# Altium schematic sheet NNP-DWG-125-001-000 PG4 Schematic Drawing Pg7.SchDoc
size B; Address1: 300 Artini St.; Address2: Oberlin, OH  44074; DocumentNumber: 51-2002-01; Revision: 04; SheetNumber: 7; SheetTotal: 8; PageSetup: Record=PageOptions|CenterHorizontal=True|CenterVertical=True|PrintScale=1.09|XCorrection=1.00|YCorrection=1.00|PrintKind=0|BorderSize=5000000|LeftOffset=0|BottomOffset=0|Orientation=2|PaperLength=4318|PaperWidth=2794|Scale=100|PaperSource=7|PrintQuality=-3|MediaType=1|DitherType=10|PrintScaleMode=1|PaperKind=11" x 17"|PaperIndex=17; DocName: **
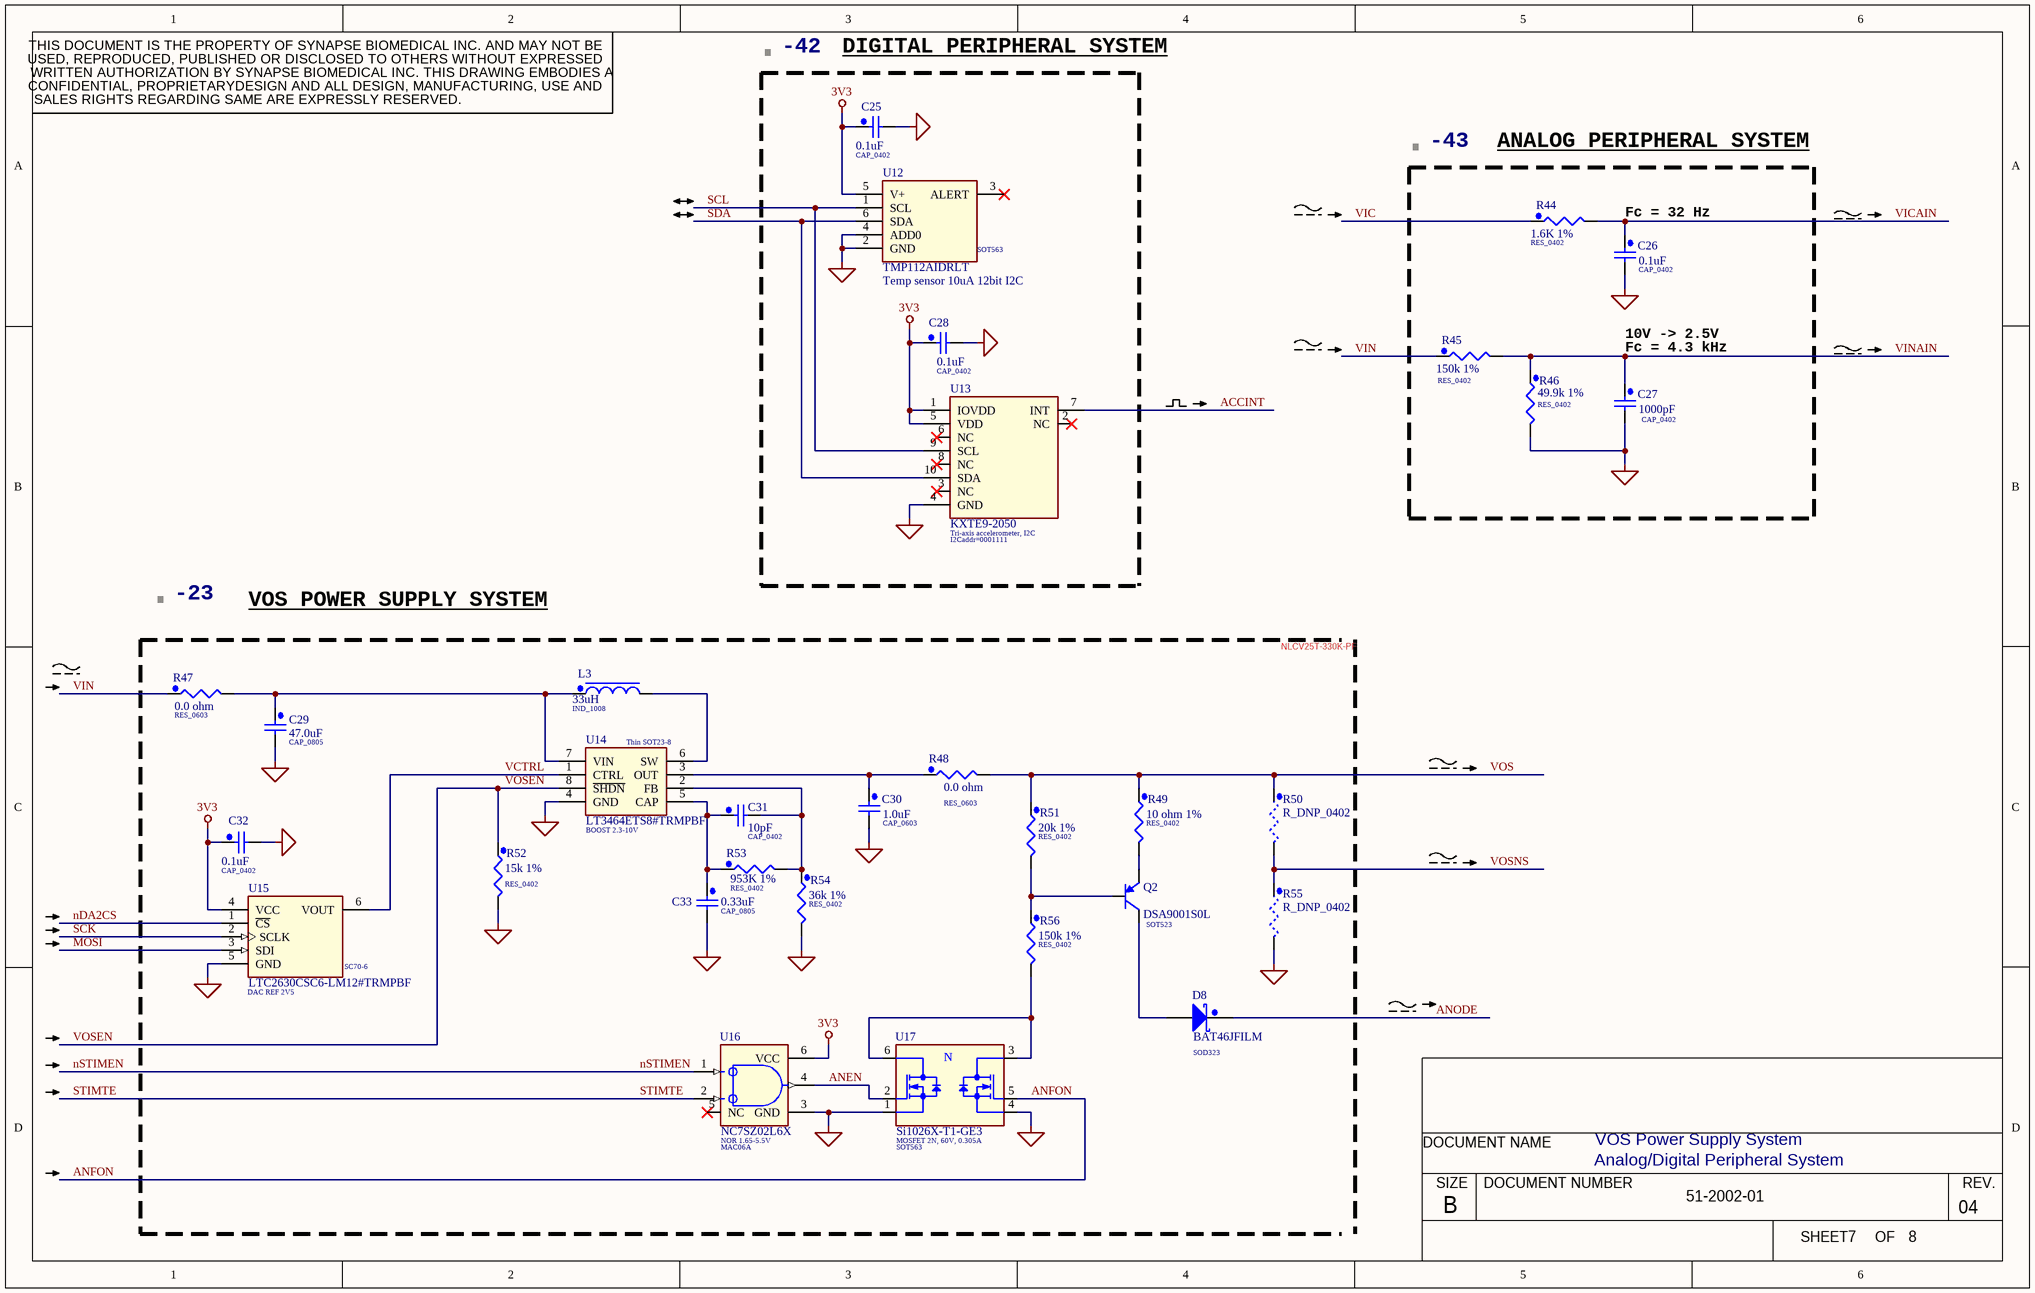
[diagram p0: NNP-DWG-125-001-000 PG4 Schematic Drawing Pg7.SchDoc]

## Parts
-23  XDESCRIPTION: VOS POWER SUPPLY SYSTEM  (hidden comment: BOM_S1)  (no BOM)
-42  XDESCRIPTION: DIGITAL PERIPHERAL SYSTEM  (hidden comment: BOM_S1)  (no BOM)
-43  XDESCRIPTION: ANALOG PERIPHERAL SYSTEM  (hidden comment: BOM_S1)  (no BOM)
C25  value 0.1uF  [CAP_0402]  (hidden comment: C_100n_X7R_16_0402_10%)
C26  value 0.1uF  [CAP_0402]  (hidden comment: C_100n_X7R_16_0402_10%)
C27  value 1000pF  [CAP_0402]  (hidden comment: C_1n_C0G_50_0402_5%)
C28  value 0.1uF  [CAP_0402]  (hidden comment: C_100n_X7R_16_0402_10%)
C29  value 47.0uF  [CAP_0805]  (hidden comment: C_47u_X5R_10_0805_20%)
C30  value 1.0uF  [CAP_0603]  (hidden comment: C_1u_X5R_50_0603_10%)
C31  value 10pF  [CAP_0402]  (hidden comment: C_10p_C0G_50_0402_5%)
C32  value 0.1uF  [CAP_0402]  (hidden comment: C_100n_X7R_16_0402_10%)
C33  value 0.33uF  [CAP_0805]  (hidden comment: C_330n_X7R_50_0805_10%)
D8  value BAT46JFILM  [SOD323]  (hidden comment: D_100_150m_SOD323)
L3  value 33uH  [IND_1008]  (hidden comment: 33uH, 120mA, 10%, RoHS)
Q2  MPN: DSA9001S0L  [SOT523]  (hidden comment: Q_-50_-100m_SOT523)
R44  value 1.6K 1%  [RES_0402]  (hidden comment: R_1k6_0402)
R45  value 150k 1%  [RES_0402]  (hidden comment: R_150k_0402)
R46  value 49.9k 1%  [RES_0402]  (hidden comment: R_49k9_0402)
R47  value 0.0 ohm  [RES_0603]  (hidden comment: R_0_0603)
R48  value 0.0 ohm  [RES_0603]  (hidden comment: R_0_0603)
R49  value 10 ohm 1%  [RES_0402]  (hidden comment: R_10_0402)
R50  R_DNP_0402  [RES_0402]  (no BOM)
R51  value 20k 1%  [RES_0402]  (hidden comment: R_20k_0402)
R52  value 15k 1%  [RES_0402]  (hidden comment: R_15k_0402)
R53  value 953K 1%  [RES_0402]  (hidden comment: R_953k_0402)
R54  value 36k 1%  [RES_0402]  (hidden comment: R_36k_0402)
R55  R_DNP_0402  [RES_0402]  (no BOM)
R56  value 150k 1%  [RES_0402]  (hidden comment: R_150k_0402)
U12  Temp sensor 10uA 12bit I2C  PackageDescription: SOT563  [SOT-563]
U13  Tri-axis accelerometer, I2C  Note: I2Caddr=0001111  [LGA10]
U14  BOOST 2.3-10V  PackageDescription: Thin SOT23-8  MPN: LT3464ETS8#TRMPBF  [SOT23-8]
U15  DAC REF 2V5  MPN: LTC2630CSC6-LM12#TRMPBF  [SC70-6]
U16  NOR 1.65-5.5V  PackageDescription: MAC06A  [uPak6]
U17  MOSFET 2N, 60V, 0.305A  PackageDescription: SOT563  MPN: Si1026X-T1-GE3  [SOT-563]

## Nets
3V3: C25.1 C28.1 C32.1 U12.5(V+) U13.1(IOVDD) U13.5(VDD) U15.4(VCC) U16.6(VCC)
GND: C25.2 C26.2 C27.2 C28.2 C29.2 C30.2 C32.2 C33.2 R46.2 R52.2 R54.2 R55.2 U12.2(GND) U12.4(ADD0) U13.4(GND) U14.4(GND) U15.5(GND) U16.3(GND) U17.1(S1) U17.4(S2)
ACCINT: U13.7(INT)
ANEN: U16.4(Y) U17.2(G1)
ANFON: U17.5(G2)
ANODE: D8.1(C)
MOSI: U15.3(SDI)
nDA2CS: U15.1(~{CS})
nSTIMEN: U16.1(A)
SCK: U15.2(SCLK)
SCL: U12.1(SCL) U13.9(SCL)
SDA: U12.6(SDA) U13.10(SDA)
STIMTE: U16.2(B)
VCTRL: U14.1(CTRL) U15.6(VOUT)
VIC: R44.1
VICAIN: C26.1 R44.2
VIN: R45.1 R47.1
VINAIN: C27.1 R45.2 R46.1
VOS: R48.2 R49.1 R50.1 R51.1
VOSEN: R52.1 U14.8(~{SHDN})
VOSNS: R50.2 R55.1
NetC29_1: C29.1 L3.1 R47.2 U14.7(VIN)
NetC30_1: C30.1 R48.1 U14.3(OUT)
NetC31_1: C31.1 C33.1 R53.1 U14.5(CAP)
NetC31_2: C31.2 R53.2 R54.1 U14.2(FB)
NetD8_2: D8.2(A) Q2.3(C)
NetL3_2: L3.2 U14.6(SW)
NetQ2_1: Q2.1(B) R51.2 R56.1
NetQ2_2: Q2.2(E) R49.2
NetR56_2: R56.2 U17.3(D2) U17.6(D1)

Not connected (* = marked no-connect by the designer): U12 3(ALERT)*; U13 2(NC)* 3(NC)* 6(NC)* 8(NC)*; U16 5(NC)*

## Notes on the sheet
- Fc = 32 Hz
- (near C27) Fc = 4.3 kHz
- 10V -> 2.5V
- NLCV25T-330K-PF
- VOS Power Supply System
- Analog/Digital Peripheral System
- SALES RIGHTS REGARDING SAME ARE EXPRESSLY RESERVED.
- THIS DOCUMENT IS THE PROPERTY OF SYNAPSE BIOMEDICAL INC. AND MAY NOT BE
- USED, REPRODUCED, PUBLISHED OR DISCLOSED TO OTHERS WITHOUT EXPRESSED
- CONFIDENTIAL, PROPRIETARYDESIGN AND ALL DESIGN, MANUFACTURING, USE AND
- WRITTEN AUTHORIZATION BY SYNAPSE BIOMEDICAL INC. THIS DRAWING EMBODIES A
- DOCUMENT NAME
- SIZE
- B
- DOCUMENT NUMBER
- SHEET
- OF
- REV.
- (in symbol Si1026X-T1-E3) N

## Library data of the parts
-23 -42 -43 = BOM_S1: BOM item small graphic
C25 C26 C28 C32 = GRM155R71C104KA88D: 0.1uF, 16V, X7R, 0402, RoHS; MFR: Murata Electronics North America; VTPN: CC5100-KJX16R13; SBI: 51-0040-1; NNPN: 00-20-1072; PackageDescription: CAP_0402; Supplier 1: Digi-Key; Supplier Part Number 1: 490-3261-2-ND; MPN: GRM155R71C104KA88D
C27 = GRM1555C1H102JA01D: 1000pF, 50V, C0G, 5%, 0402, RoHS; MFR: Murata Electronics North America; VTPN: CC3100-JJN50R10; SBI: 53-0041-2; NNPN: 00-20-0585; PackageDescription: CAP_0402; Supplier 1: Digi-Key; Supplier Part Number 1: 490-3244-1-ND; MPN: GRM1555C1H102JA01D
C29 = C2012X5R1A476M125AC: 47uF, 10V, X5R, 20%, 0805, RoHS; MFR: TDK Corporation; VTPN: CC7470-MBA10RC7; SBI: 53-0038; NNPN: 00-20-1606; PackageDescription: CAP_0805; Supplier 1: Digi-Key; Supplier Part Number 1: 445-8239-6-ND; MPN: C2012X5R1A476M125AC
C30 = UMK107BJ105KA-T: 1uF, 50V, X5R, 10%, 0603, RoHS; MFR: Murata Electronics North America; MPN: GRM188R61H105KAALD; VTPN: CC6100-KHA50RC7; SBI: 53-0037; NNPN: 00-20-1078; PackageDescription: CAP_0603; Supplier 1: Digi-Key; Supplier Part Number 1: 490-10732-6-ND; MPN2: GRT188R61H105KE13D; Supplier Part Number 2: 490-12330-2-ND
C31 = GRM1555C1H100JZ01: 10pF, 50V, C0G, 5%, 0402, RoHS; MFR: Murata Electronics North America; MPN: GRM1555C1H100JA01D; VTPN: CC1100-JJN50R13; SBI: 53-0041-3; NNPN: 00-20-0551; PackageDescription: CAP_0402; Supplier 1: Digi-Key; Supplier Part Number 1: 490-5921-6-ND
C33 = GRM219R71H334KA88D: 0.33uF, 50V, X7R, 10%, 0805, RoHS; MFR: Murata Electronics North America; MPN: GRM216R71H331KA01D; VTPN: CC5330-KBX50RC9; SBI: 53-0047; NNPN: 00-20-1591; PackageDescription: CAP_0805; Supplier 1: Digi-Key; Supplier Part Number 1: 490-11570-6-ND
D8 = BAT46JFILM: Schottky Diode, 100V, 150mA, SOD323, RoHS; MFR: STMicroelectronics; VTPN: DRBAT46J-S12RC7; SBI: 54-0076; NNPN: 00-05-1016; PackageDescription: SOD323; Supplier 1: Digi-Key; Supplier Part Number 1: 497-6653-1-ND; MPN: BAT46JFILM
L3 = ELJ-PC330KF: MFR: TDK Corporation; MPN: NLCV25T-330K-PF; VTPN: IS4330-K000RC7; SBI: 53-0034; Supplier 1: Digi-Key; PackageDescription: IND_1008; NNPN: 00-45-0021; Supplier Part Number 1: 445-1759-6-ND
Q2 = DSA9001: PNP, -50V, -100mA, SOT523, 150MHz, RoHS; MFR: Panasonic Electronic Components; VTPN: TSDSA900-S0RC7; SBI: 54-0050; PackageDescription: SOT523; NNPN: 00-06-2520; Supplier 1: Digi-Key; Supplier Part Number 1: DSA9001S0LDKR-ND; Value: PNP
R44 = CRCW04021K60FKED: 1.6K ohm, 1%, 1/16W, smd, 0402, RoHS; MFR: Vishay; VTPN: RC3160-FI006RC7; SBI: 53-0049-10; NNPN: 00-11-1591; PackageDescription: RES_0402; Supplier 1: Digi-Key; Supplier Part Number 1: 541-1.60KLCT-ND; MPN: CRCW04021K60FKED
R45 R56 = MCR01MZPF1503: 150k ohm, 1%, 1/16W, smd, 0402, RoHS; MFR: Vishay Dale; MPN: CRCW0402150KFKED; VTPN: RC5150-FI006RC7; SBI: 53-0049-11; NNPN: 00-11-1500; PackageDescription: RES_0402; Supplier 1: Digi-Key; Supplier Part Number 1: 541-150KLDKR-ND
R46 = MCR01MZPF4992: 49.9k ohm, 1%, 1/16W, 0402, RoHS; MFR: Vishay Dale; MPN: CRCW040249K9FKED; VTPN: RC4499-FI006RC9; SBI: 53-0049-2; NNPN: 00-11-1455; PackageDescription: RES_0402; Supplier 1: Digi-Key; Supplier Part Number 1: 541-49.9KLDKR-ND
R47 R48 = MCR03ERTJ000: 0.0 ohm, 1/10W, 0603, RoHS; MFR: Vishay Dale; VTPN: RC0000-BH010RC9; SBI: 53-0050; NNPN: 00-11-2000; PackageDescription: RES_0603; Supplier 1: Digi-Key; Supplier Part Number 1: RHM0.0CGCT-ND; MPN: MCR03ERTJ000
R49 = MCR01MZPF10R0: 10 ohm, 1%, 1/16W, 0402, RoHS; MFR: Vishay Dale; MPN: CRCW040210R0FKED; VTPN: RC1100-FI006RC8; SBI: 53-0049-12; NNPN: 00-11-1100; PackageDescription: RES_0402; Supplier 1: Digi-Key; Supplier Part Number 1: 541-10.0LDKR-ND
R50 R55 = R_DNP_0402: 0.0 ohm 1/16W smd 0402 RoHS; MFR: DO NOT POPULATE; MPN: DO NOT POPULATE; PackageDescription: RES_0402
R51 = MCR01MZPF2002: 20k ohm, 1%, 1/16W, 0402, RoHS; MFR: Vishay Dale; MPN: CRCW040220K0FKED; VTPN: RC4200-FI006R10; SBI: 53-0049-13; NNPN: 00-11-1417; PackageDescription: RES_0402; Supplier 1: Digi-Key; Supplier Part Number 1: 541-20.0KLDKR-ND
R52 = MCR01MZPF1502: 15.0k ohm, 1%, 1/16W, smd, 0402, RoHS; MFR: Vishay Dale; MPN: CRCW040215K0FKED; VTPN: RC4150-FI006RC9; SBI: 53-0049-9; NNPN: 00-11-1405; PackageDescription: RES_0402; Supplier 1: Digi-Key; Supplier Part Number 1: 541-15.0KLDKR-ND
R53 = CRCW0402953KFKED: 953k ohm, 1%, 1/16W, 0402, RoHS; MFR: Vishay Dale; VTPN: RC5953-FI006RC8; SBI: 53-0049-14; NNPN: 00-11-1576; PackageDescription: RES_0402; Supplier 1: Digi-Key; Supplier Part Number 1: 541-953KLCT-ND; MPN: CRCW0402953KFKED
R54 = MCR01MZPF3602: 36k ohm , 1%, 1/16W, 0402, RoHS; MFR: Vishay Dale; MPN: CRCW040236K0FKED; VTPN: RC4360-FI006RC8; SBI: 53-0049-15; NNPN: 00-11-1584; PackageDescription: RES_0402; Supplier 1: Digi-Key; Supplier Part Number 1: 541-36.0KLDKR-ND
U12 = TMP112AIDRLT: Temperature Sensor,12bit I2C,  SOT563, RoHS; MFR: Texas Instruments; VTPN: EMVTMP112-SRC7; SBI: 54-0062; NNPN: 00-02-5001; Supplier 1: Digi-Key; Supplier Part Number 1: 296-24621-1-ND; MPN: TMP112AIDRLT
U13 = KXTE9-2050: Tri-axis accelerometer, I2C,  LGA10, RoHS; MFR: Kionix; VTPN: HM900992-1ARC7; SBI: 54-0074; NNPN: 00-02-5101; PackageDescription: LGA10; Supplier 1: Mouser; Supplier Part Number 1: 912-KXTE9-2050; MPN: KXTE9-2050
U14 = LT3464ETS8: BOOST, 2.3-10V, TSOT23-8, RoHS; MFR: Linear Technology; Note: Vout=Vctrl*(Rtop/Rbot +1); VTPN: ELRLT3464-SRC7; SBI: 54-0063; ComponentLink1URL: Q:\00\02\00-02-3500 Linear Technology LT3464.pdf; NNPN: 00-02-3500; Supplier 1: Digi-Key; Supplier Part Number 1: LT3464ETS8#TRMPBFDKR-ND
U15 = LTC2630-LM12: DAC 2V5 internal reference, RoHS; MFR: Linear Technology; VTPN: EINLTC263-SRC7; SBI: 54-0064; NNPN: 00-02-0503; PackageDescription: SC70-6; Supplier 1: Digi-Key; Supplier Part Number 1: LTC2630CSC6-LM12#TRMPBFDKR-ND
U16 = NC7SZ02L6X: 2-Input NOR, 1.65-5.5V, uPak6, RoHS; MFR: Fairchild Semiconductor; VTPN: EINNC7SZ0-SRC7; SBI: 54-0065; NNPN: 00-04-1002; Supplier 1: Digi-Key; Supplier Part Number 1: NC7SZ02L6XDKR-ND; MPN: NC7SZ02L6X
U17 = Si1026X-T1-E3: MOSFET 2N, 60V, 0.305A, RoHS; MFR: Vishay Siliconix; Value: 500mA; VTPN: TPSI1026-M0RC8; SBI: 54-0066; NNPN: 00-06-2501; Supplier 1: Digi-Key; Supplier Part Number 1: SI1026X-T1-GE3DKR-ND; Parameter 1: *; MPN2: Si1026X-T1-GE3; Supplier Part Number 2: SI1026X-T1-GE3TR-ND